# EAGLE schematic Shift Registers (EAGLE 6.4)
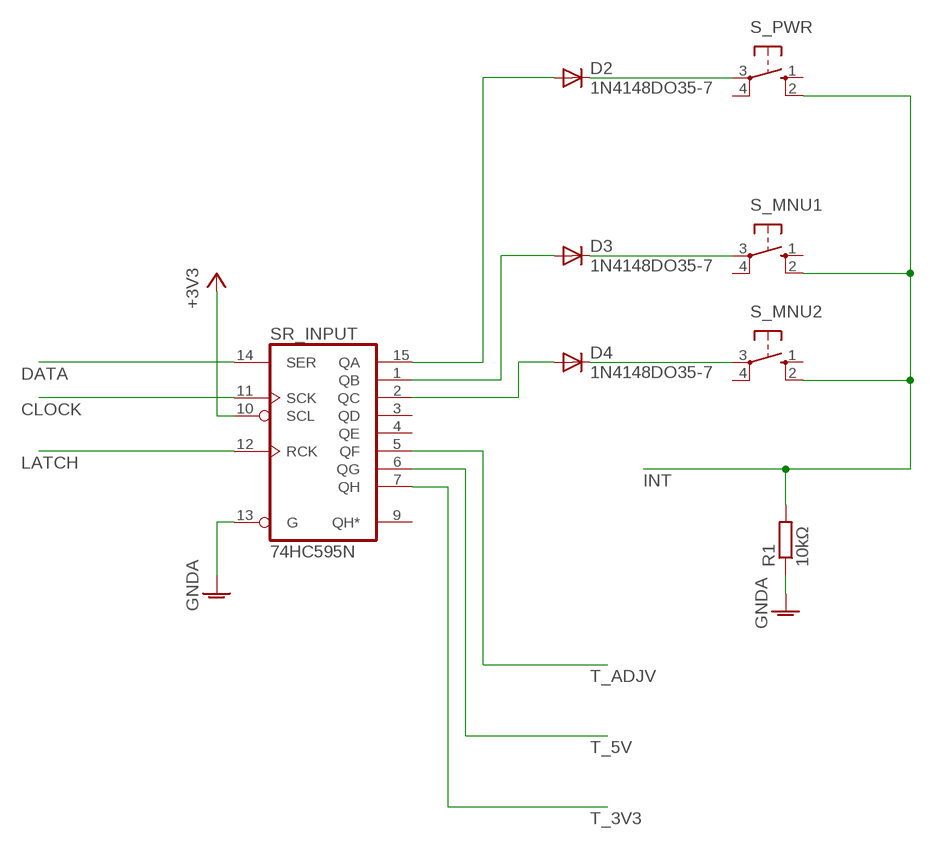
[diagram p0: schematic, sheet 1]

## Parts
D2  1N4148DO35-7  [DO35-7]
D3  1N4148DO35-7  [DO35-7]
D4  1N4148DO35-7  [DO35-7]
R1  10kΩ  R-EU_0207/10  [0207/10]
S_MNU1  10-XX  [B3F-10XX]
S_MNU2  10-XX  [B3F-10XX]
S_PWR  10-XX  [B3F-10XX]
SR_INPUT  74HC595N  [DIL16]

## Nets
+3V3: SR_INPUT.10(SCL)
CLOCK: SR_INPUT.11(SCK)
DATA: SR_INPUT.14(SER)
GNDA: R1.1 SR_INPUT.13(G)
INT: R1.2 S_MNU1.2(S1) S_MNU2.2(S1) S_PWR.2(S1)
LATCH: SR_INPUT.12(RCK)
N$2: D2.C S_PWR.3(P)
N$3: D3.C S_MNU1.3(P)
N$4: D4.C S_MNU2.3(P)
N$11: D3.A SR_INPUT.1(QB)
N$16: D4.A SR_INPUT.2(QC)
N$17: D2.A SR_INPUT.15(QA)
T_3V3: SR_INPUT.7(QH)
T_5V: SR_INPUT.6(QG)
T_ADJV: SR_INPUT.5(QF)
Unconnected: S_MNU1.1(S) S_MNU1.4(P1) S_MNU2.1(S) S_MNU2.4(P1) S_PWR.1(S) S_PWR.4(P1) SR_INPUT.3(QD) SR_INPUT.4(QE) SR_INPUT.9(QH*)

## Power pins joined to a net without a drawn wire
GND: SR_INPUT.8(GND)
VCC: SR_INPUT.16(VCC)

## Library data of the parts
D2-D4 = diode:1N4148: DIODE high speed (Philips)
R1 = resistor:R-EU_: RESISTOR, European symbol
S_MNU1 S_MNU2 S_PWR = switch-omron:10-XX: OMRON SWITCH; MPN: B3F-1000; OC_FARNELL: 176432; OC_NEWARK: 36M3542
SR_INPUT = 74xx-eu:74*595: 8-bit SHIFT REGISTER, output latch